# Altium project EEG Measurement B'd.PrjPcb
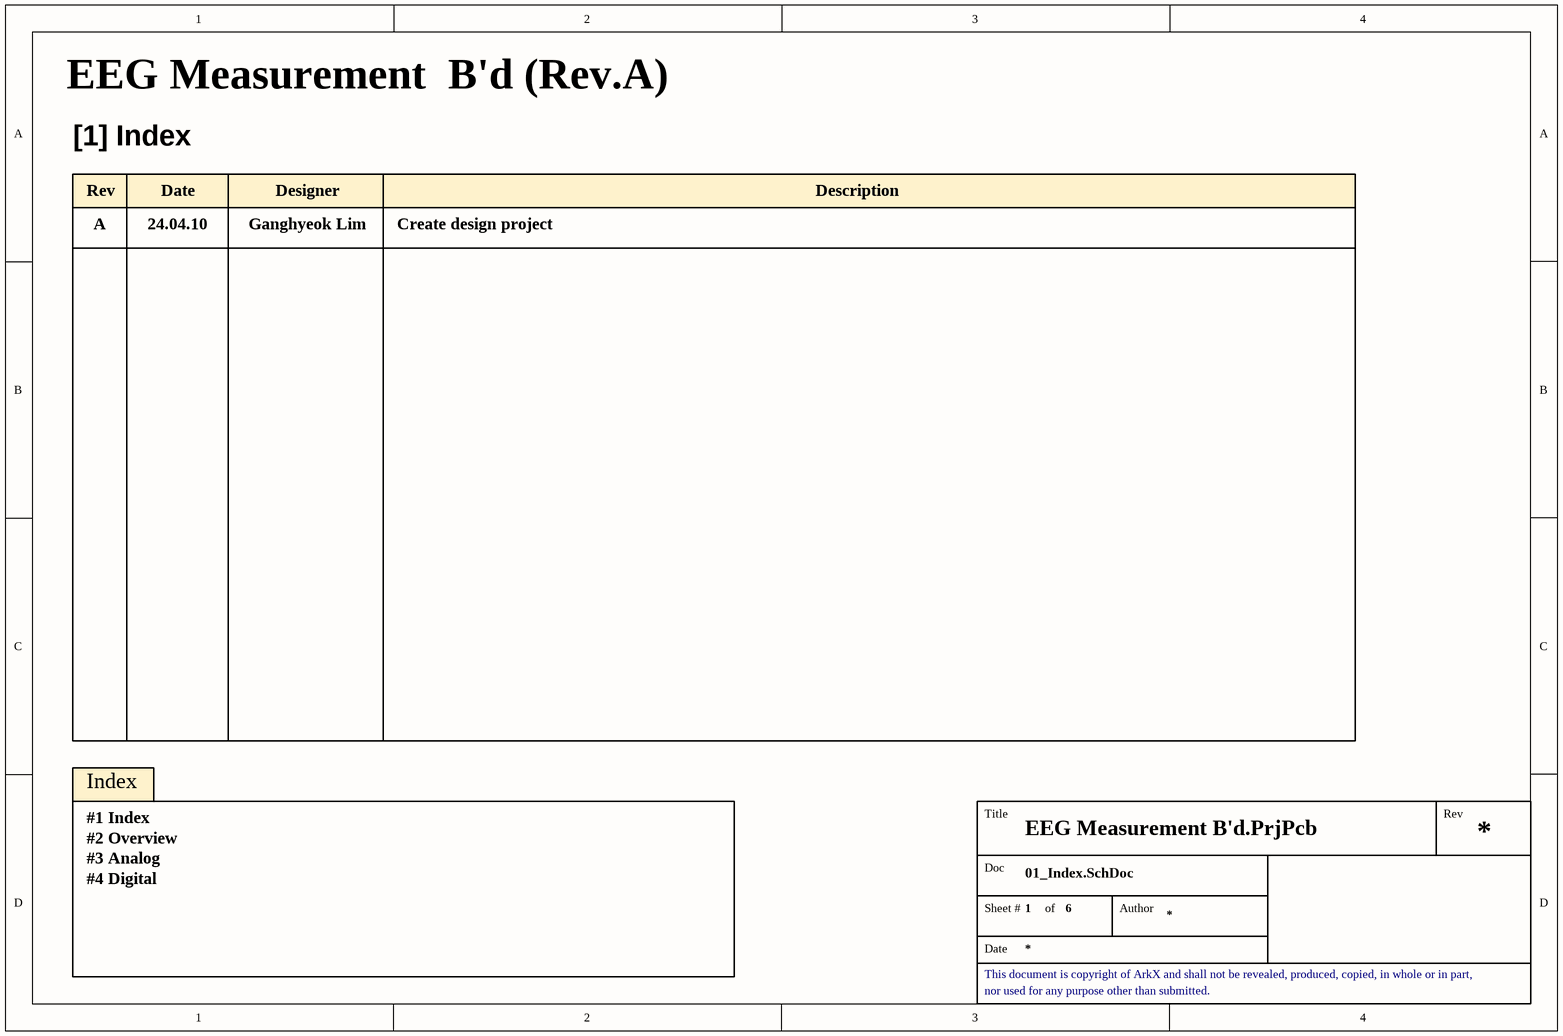
[diagram p0: 01_Index.SchDoc]
5 sheets, 171 parts. Net scope: flat (ports and power ports of the same name join across sheets).
Board file: EEG_Measurement_Bd.PcbDoc
Sheets:
  01_Index.SchDoc
  02_Overview.SchDoc
  03_Power.SchDoc
  04_Analog_Part.SchDoc
  05_Connector.SchDoc

## Sheet 01_Index.SchDoc
size A4; SheetNumber: 1; SheetTotal: 6

### Notes on the sheet
- EEG Measurement  B'd (Rev.A)
- [1] Index
- Rev
- A
- 24.04.10
- Date
- Ganghyeok Lim
- Designer
- Create design project
- Description
- Index
- #1 Index
- #2 Overview
- #3 Analog
- #4 Digital
- Title
- Doc
- Sheet #
- of
- Author
- This document is copyright of ArkX and shall not be revealed, produced, copied, in whole or in part,
- nor used for any purpose other than submitted.

## Sheet 02_Overview.SchDoc
size A4; SheetNumber: 2; SheetTotal: 5
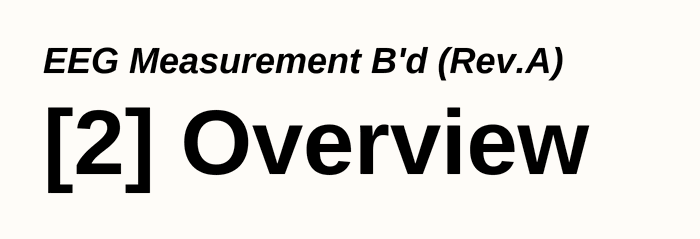
[diagram p1: 02_Overview.SchDoc]

### Notes on the sheet
- EEG Measurement B'd (Rev.A)
- [2] Overview

## Sheet 03_Power.SchDoc
size A3; SheetNumber: 3; SheetTotal: 5
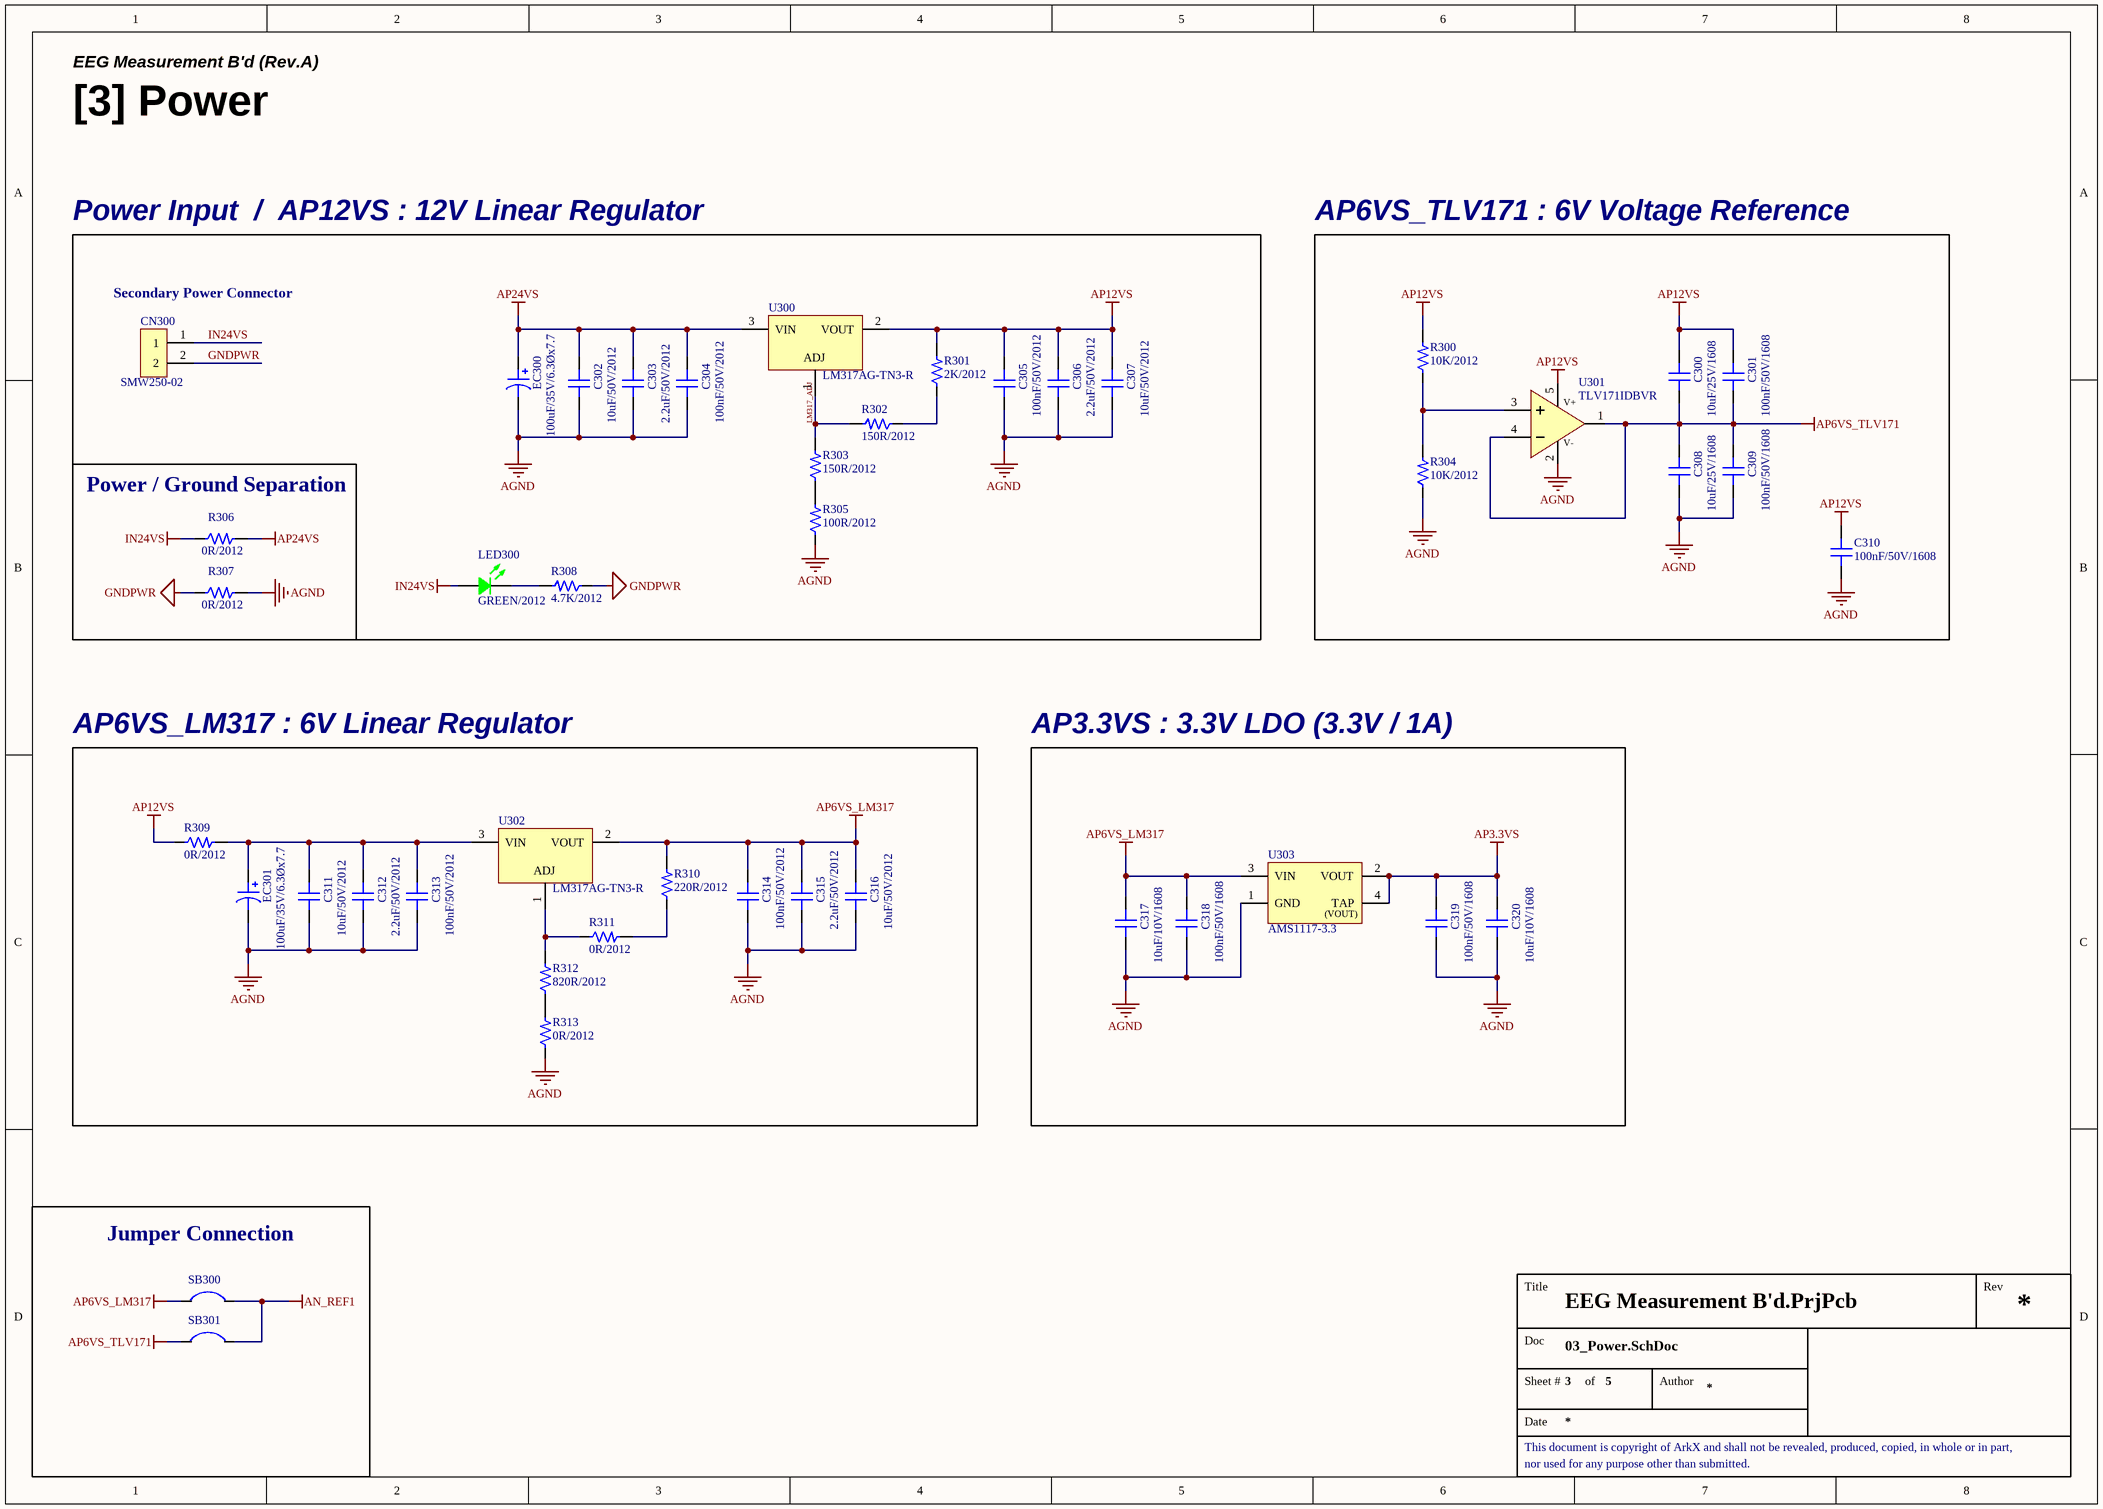
[diagram p2: 03_Power.SchDoc]

### Parts
C300  10uF/25V/1608  [CAP 1608 (0603_INCH)]
C301  100nF/50V/1608  [CAP 1608 (0603_INCH)]
C302  10uF/50V/2012  [CAP 2012 (0805_INCH)]
C303  2.2uF/50V/2012  [CAP 2012 (0805_INCH)]
C304  100nF/50V/2012  [CAP 2012 (0805_INCH)]
C305  100nF/50V/2012  [CAP 2012 (0805_INCH)]
C306  2.2uF/50V/2012  [CAP 2012 (0805_INCH)]
C307  10uF/50V/2012  [CAP 2012 (0805_INCH)]
C308  10uF/25V/1608  [CAP 1608 (0603_INCH)]
C309  100nF/50V/1608  [CAP 1608 (0603_INCH)]
C310  100nF/50V/1608  [CAP 1608 (0603_INCH)]
C311  10uF/50V/2012  [CAP 2012 (0805_INCH)]
C312  2.2uF/50V/2012  [CAP 2012 (0805_INCH)]
C313  100nF/50V/2012  [CAP 2012 (0805_INCH)]
C314  100nF/50V/2012  [CAP 2012 (0805_INCH)]
C315  2.2uF/50V/2012  [CAP 2012 (0805_INCH)]
C316  10uF/50V/2012  [CAP 2012 (0805_INCH)]
C317  10uF/10V/1608  [CAP 1608 (0603_INCH)]
C318  100nF/50V/1608  [CAP 1608 (0603_INCH)]
C319  100nF/50V/1608  [CAP 1608 (0603_INCH)]
C320  10uF/10V/1608  [CAP 1608 (0603_INCH)]
CN300  SMW250-02  [CON_SMW250-02]
EC300  100uF/35V/6.3Øx7.7  [CAP ALSMD 6.6MM H7.7MM]
EC301  100uF/35V/6.3Øx7.7  [CAP ALSMD 6.6MM H7.7MM]
LED300  GREEN/2012  [LED MHT170RGBCT (GREEN)]
R300  10K/2012  [RES 2012 (0805_inch)]
R301  2K/2012  [RES 2012 (0805_inch)]
R302  150R/2012  [RES 2012 (0805_inch)]
R303  150R/2012  [RES 2012 (0805_inch)]
R304  10K/2012  [RES 2012 (0805_inch)]
R305  100R/2012  [RES 2012 (0805_inch)]
R306  0R/2012  [RES 2012 (0805_inch)]
R307  0R/2012  [RES 2012 (0805_inch)]
R308  4.7K/2012  [RES 2012 (0805_inch)]
R309  0R/2012  [RES 2012 (0805_inch)]
R310  220R/2012  [RES 2012 (0805_inch)]
R311  0R/2012  [RES 2012 (0805_inch)]
R312  820R/2012  [RES 2012 (0805_inch)]
R313  0R/2012  [RES 2012 (0805_inch)]
SB300  SB  [SB (Solder-Bridge)]  (value not drawn)
SB301  SB  [SB (Solder-Bridge)]  (value not drawn)
U300  LM317AG-TN3-R  [IC_TO-252-2(DPAK)]
U301  TLV171IDBVR  [SOT-23-5 (TI DBV PACKAGE)]
U302  LM317AG-TN3-R  [IC_TO-252-2(DPAK)]
U303  AMS1117-3.3  [SOT 223-3 (DIODES INCORPORATED)]

### Blocks framed on the sheet
Power Input  /  AP12VS : 12V Linear Regulator: C302-C307 CN300 EC300 LED300 R301-R303 R305 R308 U300
AP6VS_TLV171 : 6V Voltage Reference: C300 C301 C308-C310 R300 R304 U301
Power / Ground Separation: R306 R307
AP6VS_LM317 : 6V Linear Regulator: C311-C316 EC301 R309-R313 U302
AP3.3VS : 3.3V LDO (3.3V / 1A): C317-C320 U303
Jumper Connection: SB300 SB301

### Nets
AGND: C302.1 C303.1 C304.1 C305.1 C306.1 C307.1 C308.1 C309.1 C310.1 C311.1 C312.1 C313.1 C314.1 C315.1 C316.1 C317.1 C318.1 C319.1 C320.1 EC300.2 EC301.2 R304.1 R305.1 R307.2 R313.1 U301.2(V-) U303.1(GND)
AN_REF1: SB300.1 SB301.1
AP3.3VS: C319.2 C320.2 U303.2(VOUT) U303.4(TAP)
AP6VS_LM317: C314.2 C315.2 C316.2 C317.2 C318.2 R310.2 SB300.2 U302.2(VOUT) U303.3(VIN)
AP6VS_TLV171: C300.1 C301.1 C308.2 C309.2 SB301.2 U301.1(OUT) U301.4(IN-)
AP12VS: C300.2 C301.2 C305.2 C306.2 C307.2 C310.2 R300.2 R301.2 R309.1 U300.2(VOUT) U301.5(V+)
AP24VS: C302.2 C303.2 C304.2 EC300.1 R306.2 U300.3(VIN)
GNDPWR: CN300.2 R307.1 R308.1
IN24VS: CN300.1 LED300.4(Common_Anode) R306.1
LM317_ADJ: R302.2 R303.2 U300.1(ADJ)
NetC311_2: C311.2 C312.2 C313.2 EC301.1 R309.2 U302.3(VIN)
NetLED300_2: LED300.2(GREEN) R308.2
NetR300_1: R300.1 R304.2 U301.3(IN+)
NetR301_1: R301.1 R302.1
NetR303_1: R303.1 R305.2
NetR310_1: R310.1 R311.2
NetR311_1: R311.1 R312.2 U302.1(ADJ)
NetR312_1: R312.1 R313.2

### Notes on the sheet
- EEG Measurement B'd (Rev.A)
- [3] Power
- (near CN300) Secondary Power Connector
- Title
- Rev
- Doc
- Sheet #
- of
- Author
- This document is copyright of ArkX and shall not be revealed, produced, copied, in whole or in part,
- Date
- nor used for any purpose other than submitted.
- (in symbol IC_REG_AMS1117-3.3) (VOUT)

### Library data of the parts
C300 C308 = CAP_10uF/25V/1608: Ceramic CAP_10uF/25V/1608; LCSC Part #: C96446; JLCPCB Part Type: Basic Part
C301 C309 C310 C318 C319 = CAP_100nF/50V/1608: Ceramic CAP_100nF/50V/1608; LCSC Part #: C14663; JLCPCB Part Type: Basic Part
C302 C307 C311 C316 = CAP_10uF/50V/2012: Ceramic CAP_10uF/50V/2012; LCSC Part #: C440198; JLCPCB Part Type: Basic Part
C303 C306 C312 C315 = CAP_2.2uF/50V/2012: Ceramic CAP_2.2uF/50V/2012; LCSC Part #: C377773; JLCPCB Part Type: Basic Part
C304 C305 C313 C314 = CAP_100nF/50V/2012: Ceramic CAP_100nF/50V/2012; LCSC Part #: C49678; JLCPCB Part Type: Basic Part
C317 C320 = CAP_10uF/10V/1608: Ceramic CAP_10uF/10V/1608; LCSC Part #: C19702; JLCPCB Part Type: Basic Part
CN300 = CON_SMW250-02: YEONHO 2.5mm Pitch Vertical Connector 2Pin
EC300 EC301 = CAP_EC 100uF/35V/6.3Øx7.7: Eletrolytic CAP_100uF/35V/6.3Øx7.7; LCSC Part #: C176666; JLCPCB Part Type: Extended Part
LED300 = LED_MHT170RGBCT(GREEN): Colorless transparence -30℃~+85℃ Positive post Common anode RGB 120° 0805  Light Emitting Diodes (LED) ROHS; LCSC Part #: C2962094; JLCPCB Part Type: Extended Part
R300 R304 = RES_10K/2012/0.125W: Value: 10K; Power Rating: 0.125W; Precision: 1%; Size: 2012; LCSC Part #: C17414; JLCPCB Part Type: Basic Part
R301 = RES_2K/2012/0.125W: Value: 2K; Power Rating: 0.125W; Precision: 1%; Size: 2012; LCSC Part #: C17604; JLCPCB Part Type: Basic Part
R302 R303 = RES_150R/2012/0.125W: Value: 150R; Power Rating: 0.1W; Precision: 1%; Size: 1608; LCSC Part #: C17471; JLCPCB Part Type: Basic Part
R305 = RES_100R/2012/0.125W: Value: 100R; Power Rating: 0.125W; Precision: 1%; Size: 2012; LCSC Part #: C17408; JLCPCB Part Type: Basic Part
R306 R307 R309 R311 R313 = RES_0R/2012/0.125W: Value: 0R; Power Rating: 0.125W; Precision: 1%; Size: 2012; LCSC Part #: C17477; JLCPCB Part Type: Basic Part
R308 = RES_4.7K/2012/0.125W: Value: 4.7K; Power Rating: 0.125W; Precision: 1%; Size: 2012; LCSC Part #: C17673; JLCPCB Part Type: Basic Part
R310 = RES_220R/2012/0.125W: Value: 220R; Power Rating: 0.125W; Precision: 1%; Size: 2012; LCSC Part #: C17557; JLCPCB Part Type: Basic Part
R312 = RES_820R/2012/0.125W: Value: 820R; Power Rating: 0.125W; Precision: 1%; Size: 2012; LCSC Part #: C17837; JLCPCB Part Type: Basic Part
SB300 SB301 = SB_Solder-Bridge
U300 U302 = IC_REG_LM317AG-TN3-R: 1.5A 5V@(500mA) Adjustable 1.2V~37V Positive 1 40V TO-252-2(DPAK)  Linear Voltage Regulators (LDO) ROHS; LCSC Part #: C75510; JLCPCB Part Type: Basic Part
U301 = IC_OPAMP_TLV171IDBVR: Single, 36-V, 3-MHz, low-power operational amplifier for cost-sensitive applications; LCSC Part #: C2864299; JLCPCB Part Type: Extended Part
U303 = IC_REG_AMS1117-3.3: 72dB@(120Hz) 1A 1.3V@(800mA) Fixed 3.3V~3.3V Positive 1 SOT-223  Linear Voltage Regulators (LDO) ROHS; LCSC Part #: C6186; JLCPCB Part Type: Basic Part

## Sheet 04_Analog_Part.SchDoc
size A2; SheetNumber: 4; SheetTotal: 5
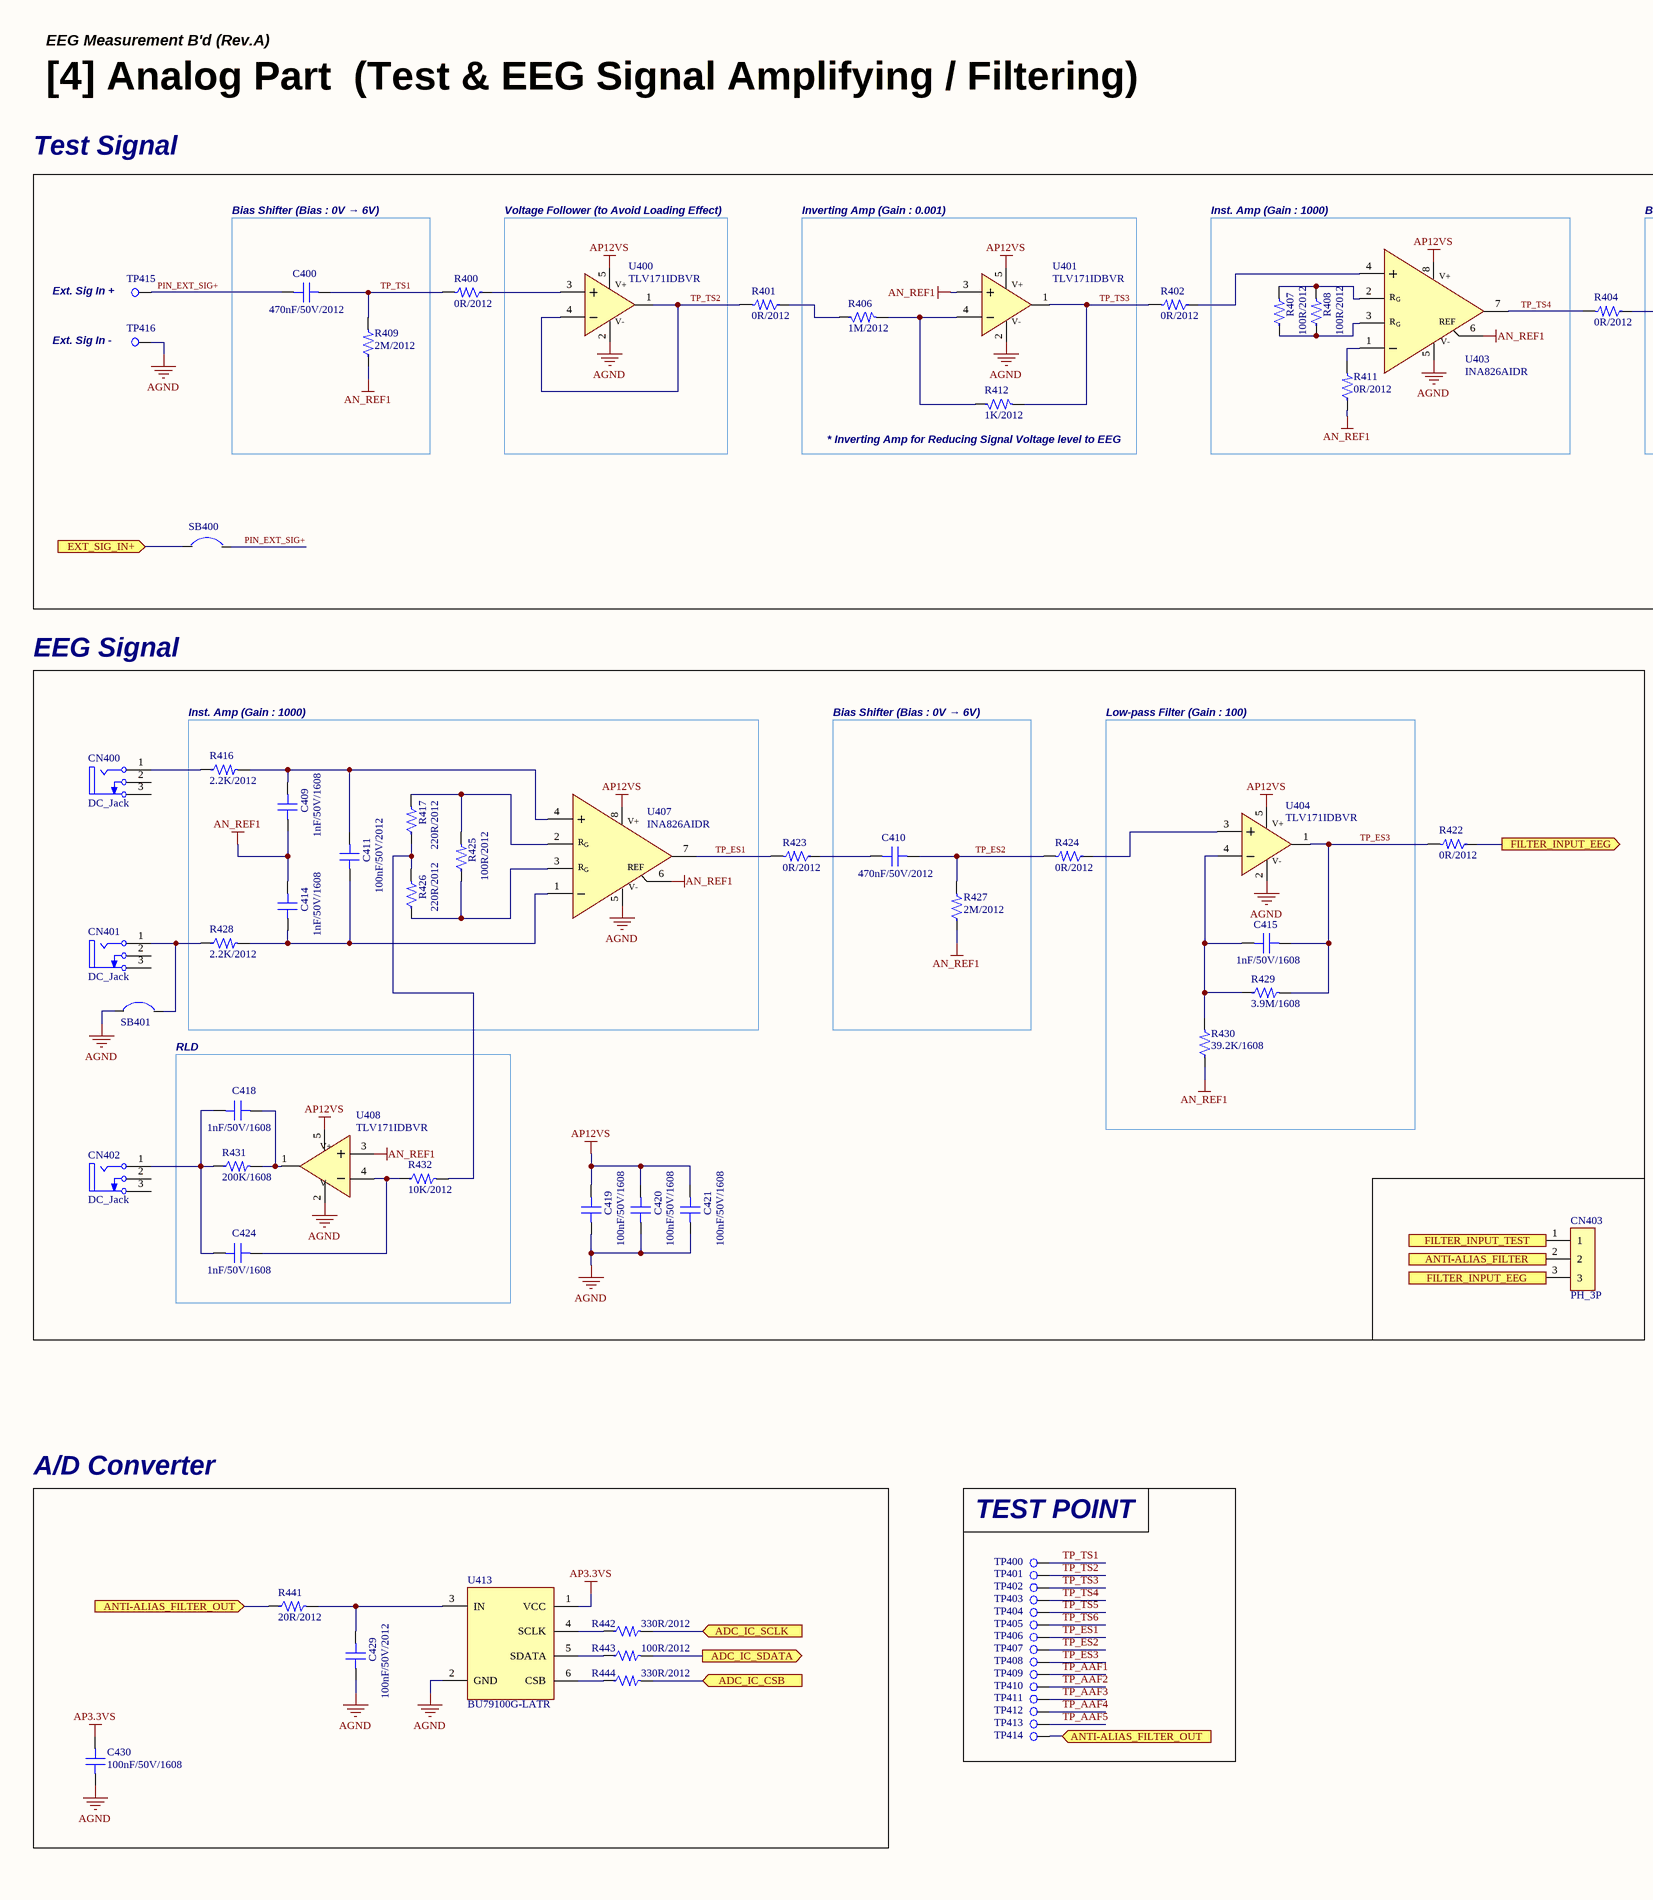
[diagram p3: 04_Analog_Part.SchDoc, left]
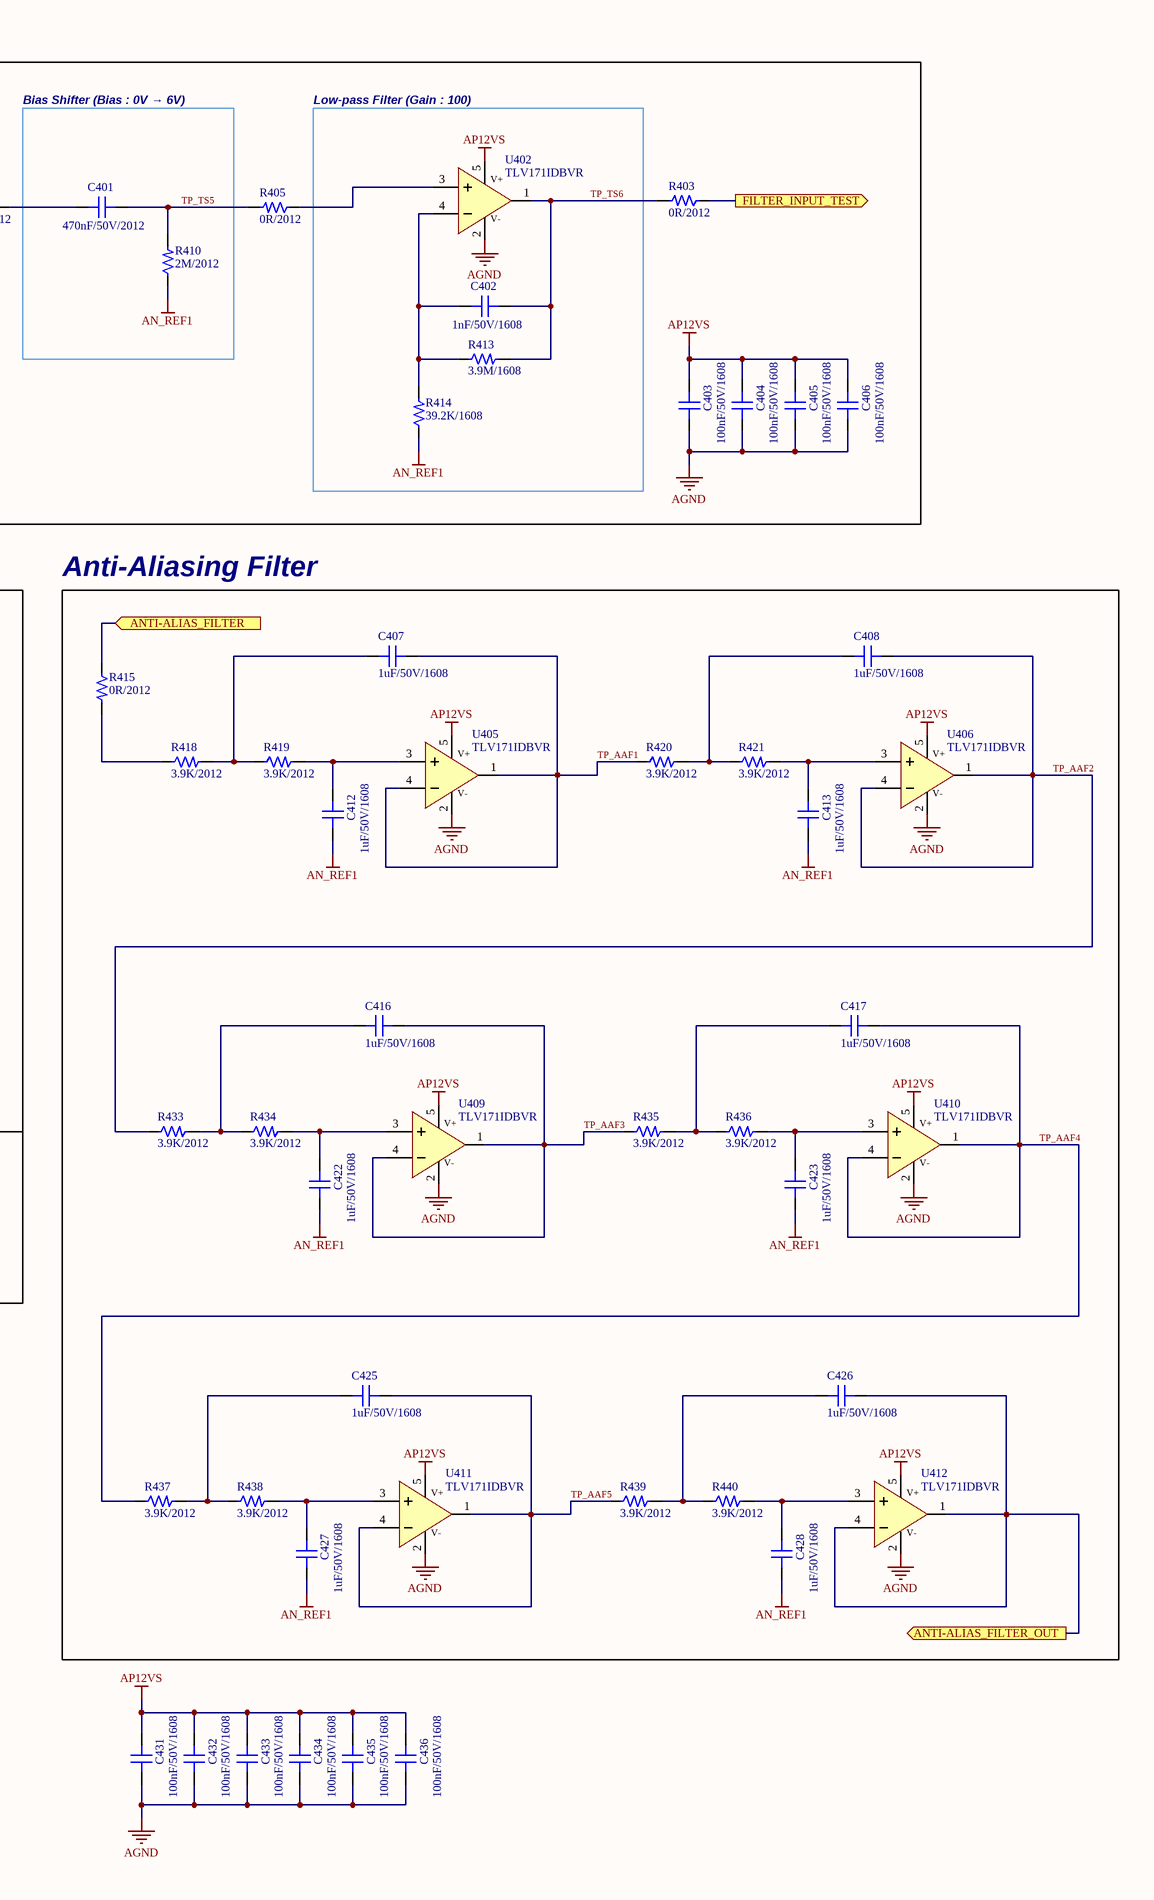
[diagram p4: 04_Analog_Part.SchDoc, right]

### Parts
C400  470nF/50V/2012  [CAP 2012 (0805_INCH)]
C401  470nF/50V/2012  [CAP 2012 (0805_INCH)]
C402  1nF/50V/1608  [CAP 1608 (0603_INCH)]
C403  100nF/50V/1608  [CAP 1608 (0603_INCH)]
C404  100nF/50V/1608  [CAP 1608 (0603_INCH)]
C405  100nF/50V/1608  [CAP 1608 (0603_INCH)]
C406  100nF/50V/1608  [CAP 1608 (0603_INCH)]
C407  1uF/50V/1608  [CAP 1608 (0603_INCH)]
C408  1uF/50V/1608  [CAP 1608 (0603_INCH)]
C409  1nF/50V/1608  [CAP 1608 (0603_INCH)]
C410  470nF/50V/2012  [CAP 2012 (0805_INCH)]
C411  100nF/50V/2012  [CAP 2012 (0805_INCH)]
C412  1uF/50V/1608  [CAP 1608 (0603_INCH)]
C413  1uF/50V/1608  [CAP 1608 (0603_INCH)]
C414  1nF/50V/1608  [CAP 1608 (0603_INCH)]
C415  1nF/50V/1608  [CAP 1608 (0603_INCH)]
C416  1uF/50V/1608  [CAP 1608 (0603_INCH)]
C417  1uF/50V/1608  [CAP 1608 (0603_INCH)]
C418  1nF/50V/1608  [CAP 1608 (0603_INCH)]
C419  100nF/50V/1608  [CAP 1608 (0603_INCH)]
C420  100nF/50V/1608  [CAP 1608 (0603_INCH)]
C421  100nF/50V/1608  [CAP 1608 (0603_INCH)]
C422  1uF/50V/1608  [CAP 1608 (0603_INCH)]
C423  1uF/50V/1608  [CAP 1608 (0603_INCH)]
C424  1nF/50V/1608  [CAP 1608 (0603_INCH)]
C425  1uF/50V/1608  [CAP 1608 (0603_INCH)]
C426  1uF/50V/1608  [CAP 1608 (0603_INCH)]
C427  1uF/50V/1608  [CAP 1608 (0603_INCH)]
C428  1uF/50V/1608  [CAP 1608 (0603_INCH)]
C429  100nF/50V/2012  [CAP 2012 (0805_INCH)]
C430  100nF/50V/1608  [CAP 1608 (0603_INCH)]
C431  100nF/50V/1608  [CAP 1608 (0603_INCH)]
C432  100nF/50V/1608  [CAP 1608 (0603_INCH)]
C433  100nF/50V/1608  [CAP 1608 (0603_INCH)]
C434  100nF/50V/1608  [CAP 1608 (0603_INCH)]
C435  100nF/50V/1608  [CAP 1608 (0603_INCH)]
C436  100nF/50V/1608  [CAP 1608 (0603_INCH)]
CN400  DC_Jack  [CON DC-Jack]
CN401  DC_Jack  [CON DC-Jack]
CN402  DC_Jack  [CON DC-Jack]
CN403  PH_3P  [CON PIN_HEADER-3PIN(2.54MM)]
R400  0R/2012  [RES 2012 (0805_inch)]
R401  0R/2012  [RES 2012 (0805_inch)]
R402  0R/2012  [RES 2012 (0805_inch)]
R403  0R/2012  [RES 2012 (0805_inch)]
R404  0R/2012  [RES 2012 (0805_inch)]
R405  0R/2012  [RES 2012 (0805_inch)]
R406  1M/2012  [RES 2012 (0805_inch)]
R407  100R/2012  [RES 2012 (0805_inch)]
R408  100R/2012  [RES 2012 (0805_inch)]
R409  2M/2012  [RES 2012 (0805_inch)]
R410  2M/2012  [RES 2012 (0805_inch)]
R411  0R/2012  [RES 2012 (0805_inch)]
R412  1K/2012  [RES 2012 (0805_inch)]
R413  3.9M/1608  [RES 1608 (0603_inch)]
R414  39.2K/1608  [RES 1608 (0603_inch)]
R415  0R/2012  [RES 2012 (0805_inch)]
R416  2.2K/2012  [RES 2012 (0805_inch)]
R417  220R/2012  [RES 2012 (0805_inch)]
R418  3.9K/2012  [RES 2012 (0805_inch)]
R419  3.9K/2012  [RES 2012 (0805_inch)]
R420  3.9K/2012  [RES 2012 (0805_inch)]
R421  3.9K/2012  [RES 2012 (0805_inch)]
R422  0R/2012  [RES 2012 (0805_inch)]
R423  0R/2012  [RES 2012 (0805_inch)]
R424  0R/2012  [RES 2012 (0805_inch)]
R425  100R/2012  [RES 2012 (0805_inch)]
R426  220R/2012  [RES 2012 (0805_inch)]
R427  2M/2012  [RES 2012 (0805_inch)]
R428  2.2K/2012  [RES 2012 (0805_inch)]
R429  3.9M/1608  [RES 1608 (0603_inch)]
R430  39.2K/1608  [RES 1608 (0603_inch)]
R431  200K/1608  [RES 1608 (0603_inch)]
R432  10K/2012  [RES 2012 (0805_inch)]
R433  3.9K/2012  [RES 2012 (0805_inch)]
R434  3.9K/2012  [RES 2012 (0805_inch)]
R435  3.9K/2012  [RES 2012 (0805_inch)]
R436  3.9K/2012  [RES 2012 (0805_inch)]
R437  3.9K/2012  [RES 2012 (0805_inch)]
R438  3.9K/2012  [RES 2012 (0805_inch)]
R439  3.9K/2012  [RES 2012 (0805_inch)]
R440  3.9K/2012  [RES 2012 (0805_inch)]
R441  20R/2012  [RES 2012 (0805_inch)]
R442  330R/2012  [RES 2012 (0805_inch)]
R443  100R/2012  [RES 2012 (0805_inch)]
R444  330R/2012  [RES 2012 (0805_inch)]
SB400  SB  [SB (Solder-Bridge)]  (value not drawn)
SB401  SB  [SB (Solder-Bridge)]  (value not drawn)
TP400  TP_HOLE(1MM)  [TP_HOLE(1MM)]  (value not drawn)
TP401  TP_HOLE(1MM)  [TP_HOLE(1MM)]  (value not drawn)
TP402  TP_HOLE(1MM)  [TP_HOLE(1MM)]  (value not drawn)
TP403  TP_HOLE(1MM)  [TP_HOLE(1MM)]  (value not drawn)
TP404  TP_HOLE(1MM)  [TP_HOLE(1MM)]  (value not drawn)
TP405  TP_HOLE(1MM)  [TP_HOLE(1MM)]  (value not drawn)
TP406  TP_HOLE(1MM)  [TP_HOLE(1MM)]  (value not drawn)
TP407  TP_HOLE(1MM)  [TP_HOLE(1MM)]  (value not drawn)
TP408  TP_HOLE(1MM)  [TP_HOLE(1MM)]  (value not drawn)
TP409  TP_HOLE(1MM)  [TP_HOLE(1MM)]  (value not drawn)
TP410  TP_HOLE(1MM)  [TP_HOLE(1MM)]  (value not drawn)
TP411  TP_HOLE(1MM)  [TP_HOLE(1MM)]  (value not drawn)
TP412  TP_HOLE(1MM)  [TP_HOLE(1MM)]  (value not drawn)
TP413  TP_HOLE(1MM)  [TP_HOLE(1MM)]  (value not drawn)
TP414  TP_HOLE(1MM)  [TP_HOLE(1MM)]  (value not drawn)
TP415  TP_HOLE(1MM)  [TP_HOLE(1MM)]  (value not drawn)
TP416  TP_HOLE(1MM)  [TP_HOLE(1MM)]  (value not drawn)
U400  TLV171IDBVR  [SOT-23-5 (TI DBV PACKAGE)]
U401  TLV171IDBVR  [SOT-23-5 (TI DBV PACKAGE)]
U402  TLV171IDBVR  [SOT-23-5 (TI DBV PACKAGE)]
U403  INA826AIDR  [IC_SOIC-8 (4.90x3.90mm)]
U404  TLV171IDBVR  [SOT-23-5 (TI DBV PACKAGE)]
U405  TLV171IDBVR  [SOT-23-5 (TI DBV PACKAGE)]
U406  TLV171IDBVR  [SOT-23-5 (TI DBV PACKAGE)]
U407  INA826AIDR  [IC_SOIC-8 (4.90x3.90mm)]
U408  TLV171IDBVR  [SOT-23-5 (TI DBV PACKAGE)]
U409  TLV171IDBVR  [SOT-23-5 (TI DBV PACKAGE)]
U410  TLV171IDBVR  [SOT-23-5 (TI DBV PACKAGE)]
U411  TLV171IDBVR  [SOT-23-5 (TI DBV PACKAGE)]
U412  TLV171IDBVR  [SOT-23-5 (TI DBV PACKAGE)]
U413  BU79100G-LATR  [IC_SOT-23-6]

### Blocks framed on the sheet
Test Signal: C403-C406 R400-R406 R412 SB400 TP415 TP416 U401
Bias Shifter (Bias : 0V → 6V): C400 R409
Voltage Follower (to Avoid Loading Effect): U400
Inst. Amp (Gain : 1000): R407 R408 R411 U403
Bias Shifter (Bias : 0V → 6V): C401 R410
Low-pass Filter (Gain : 100): C402 R413 R414 U402
EEG Signal: C419-C421 CN400-CN403 R422-R424 SB401
Anti-Aliasing Filter: C407 C408 C412 C413 C416 C417 C422 C423 C425-C428 R415 R418-R421 R433-R440 U405 U406 U409-U412
Inst. Amp (Gain : 1000): C409 C411 C414 R416 R417 R425 R426 R428 U407
Bias Shifter (Bias : 0V → 6V): C410 R427
Low-pass Filter (Gain : 100): C415 R429 R430 U404
RLD: C418 C424 R431 R432 U408
A/D Converter: C429 C430 R441-R444 U413
TEST POINT: TP400-TP414

### Ports
ADC_IC_CSB (in), ADC_IC_SCLK (in), ADC_IC_SDATA (out), ANTI-ALIAS_FILTER (in), ANTI-ALIAS_FILTER (out), ANTI-ALIAS_FILTER_OUT (in), ANTI-ALIAS_FILTER_OUT (out), EXT_SIG_IN+ (in), FILTER_INPUT_EEG (in), FILTER_INPUT_EEG (out), FILTER_INPUT_TEST (in), FILTER_INPUT_TEST (out)

### Nets
AGND: C403.1 C404.1 C405.1 C406.1 C419.1 C420.1 C421.1 C429.1 C430.1 C431.1 C432.1 C433.1 C434.1 C435.1 C436.1 SB401.1 TP416.1(TP) U400.2(V-) U401.2(V-) U402.2(V-) U403.5(V-) U404.2(V-) U405.2(V-) U406.2(V-) U407.5(V-) U408.2(V-) U409.2(V-) U410.2(V-) U411.2(V-) U412.2(V-) U413.2(GND)
AN_REF1: C409.1 C412.1 C413.1 C414.2 C422.1 C423.1 C427.1 C428.1 R409.1 R410.1 R411.1 R414.1 R427.1 R430.1 U401.3(IN+) U403.6(REF) U407.6(REF) U408.3(IN+)
AP3.3VS: C430.2 U413.1(VCC)
AP12VS: C403.2 C404.2 C405.2 C406.2 C419.2 C420.2 C421.2 C431.2 C432.2 C433.2 C434.2 C435.2 C436.2 U400.5(V+) U401.5(V+) U402.5(V+) U403.8(V+) U404.5(V+) U405.5(V+) U406.5(V+) U407.8(V+) U408.5(V+) U409.5(V+) U410.5(V+) U411.5(V+) U412.5(V+)
ADC_IC_CSB: R444.2 ; port ADC_IC_CSB
ADC_IC_SCLK: R442.2 ; port ADC_IC_SCLK
ADC_IC_SDATA: R443.2 ; port ADC_IC_SDATA
ANTI-ALIAS_FILTER: CN403.2 R415.1 ; port ANTI-ALIAS_FILTER
ANTI-ALIAS_FILTER_OUT: C426.2 R441.1 TP414.1(TP) U412.1(OUT) U412.4(IN-) ; port ANTI-ALIAS_FILTER_OUT
EXT_SIG_IN+: SB400.1 ; port EXT_SIG_IN+
FILTER_INPUT_EEG: CN403.3 R422.1 ; port FILTER_INPUT_EEG
FILTER_INPUT_TEST: CN403.1 R403.1 ; port FILTER_INPUT_TEST
PIN_EXT_SIG+: C400.1 SB400.2 TP415.1(TP)
TP_AAF1: C407.2 R420.1 TP409.1(TP) U405.1(OUT) U405.4(IN-)
TP_AAF2: C408.2 R433.1 TP410.1(TP) U406.1(OUT) U406.4(IN-)
TP_AAF3: C416.2 R435.1 TP411.1(TP) U409.1(OUT) U409.4(IN-)
TP_AAF4: C417.2 R437.1 TP412.1(TP) U410.1(OUT) U410.4(IN-)
TP_AAF5: C425.2 R439.1 TP413.1(TP) U411.1(OUT) U411.4(IN-)
TP_ES1: R423.2 TP406.1(TP) U407.7(VOUT)
TP_ES2: C410.2 R424.2 R427.2 TP407.1(TP)
TP_ES3: C415.1 R422.2 R429.2 TP408.1(TP) U404.1(OUT)
TP_TS1: C400.2 R400.2 R409.2 TP400.1(TP)
TP_TS2: R401.2 TP401.1(TP) U400.1(OUT) U400.4(IN-)
TP_TS3: R402.2 R412.2 TP402.1(TP) U401.1(OUT)
TP_TS4: R404.2 TP403.1(TP) U403.7(VOUT)
TP_TS5: C401.2 R405.2 R410.2 TP404.1(TP)
TP_TS6: C402.1 R403.2 R413.2 TP405.1(TP) U402.1(OUT)
NetC401_1: C401.1 R404.1
NetC402_2: C402.2 R413.1 R414.2 U402.4(IN-)
NetC407_1: C407.1 R418.2 R419.1
NetC408_1: C408.1 R420.2 R421.1
NetC409_2: C409.2 C411.2 R416.2 U407.4(IN+)
NetC410_1: C410.1 R423.1
NetC411_1: C411.1 C414.1 R428.2 U407.1(IN-)
NetC412_2: C412.2 R419.2 U405.3(IN+)
NetC413_2: C413.2 R421.2 U406.3(IN+)
NetC415_2: C415.2 R429.1 R430.2 U404.4(IN-)
NetC416_1: C416.1 R433.2 R434.1
NetC417_1: C417.1 R435.2 R436.1
NetC418_1: C418.1 R431.2 U408.1(OUT)
NetC418_2: C418.2 C424.2 CN402.1(VCC) R431.1
NetC422_2: C422.2 R434.2 U409.3(IN+)
NetC423_2: C423.2 R436.2 U410.3(IN+)
NetC424_1: C424.1 R432.1 U408.4(IN-)
NetC425_1: C425.1 R437.2 R438.1
NetC426_1: C426.1 R439.2 R440.1
NetC427_2: C427.2 R438.2 U411.3(IN+)
NetC428_2: C428.2 R440.2 U412.3(IN+)
NetC429_2: C429.2 R441.2 U413.3(IN)
NetCN400_1: CN400.1(VCC) R416.1
NetCN401_1: CN401.1(VCC) R428.1 SB401.2
NetR400_1: R400.1 U400.3(IN+)
NetR401_1: R401.1 R406.1
NetR402_1: R402.1 U403.4(IN+)
NetR405_1: R405.1 U402.3(IN+)
NetR406_2: R406.2 R412.1 U401.4(IN-)
NetR407_1: R407.1 R408.1 U403.3(RG-)
NetR407_2: R407.2 R408.2 U403.2(RG+)
NetR411_2: R411.2 U403.1(IN-)
NetR415_2: R415.2 R418.1
NetR417_1: R417.1 R426.2 R432.2
NetR417_2: R417.2 R425.2 U407.2(RG+)
NetR424_1: R424.1 U404.3(IN+)
NetR425_1: R425.1 R426.1 U407.3(RG-)
NetR442_1: R442.1 U413.4(SCLK)
NetR443_1: R443.1 U413.5(SDATA)
NetR444_1: R444.1 U413.6(CSB)

Not connected (* = marked no-connect by the designer): CN400 2(GND) 3(GND); CN401 2(GND) 3(GND); CN402 2(GND) 3(GND)

### Notes on the sheet
- EEG Measurement B'd (Rev.A)
- [4] Analog Part  (Test & EEG Signal Amplifying / Filtering)
- Inverting Amp (Gain : 0.001)
- (near TP415) Ext. Sig In +
- (near TP416) Ext. Sig In -
- (near R412) * Inverting Amp for Reducing Signal Voltage level to EEG
- Title
- Rev
- Doc
- Sheet #
- of
- Author
- This document is copyright of ArkX and shall not be revealed, produced, copied, in whole or in part,
- Date
- nor used for any purpose other than submitted.
- (in symbol IC_INST-AMP_INA826AIDR) R; G

### Library data of the parts
C400 C401 C410 = CAP_470nF/50V/2012: Ceramic CAP_470nF/50V/2012; LCSC Part #: C13967; JLCPCB Part Type: Basic Part
C402 C409 C414 C415 C418 C424 = CAP_1nF/50V/1608: Ceramic CAP_1nF/50V/1608; LCSC Part #: C1588; JLCPCB Part Type: Basic Part
C403-C406 C419-C421 C430-C436 = CAP_100nF/50V/1608: Ceramic CAP_100nF/50V/1608; LCSC Part #: C14663; JLCPCB Part Type: Basic Part
C407 C408 C412 C413 C416 C417 C422 C423 C425-C428 = CAP_1uF/50V/1608: Ceramic CAP_1uF/50V/1608; LCSC Part #: C15849; JLCPCB Part Type: Basic Part
C411 C429 = CAP_100nF/50V/2012: Ceramic CAP_100nF/50V/2012; LCSC Part #: C49678; JLCPCB Part Type: Basic Part
CN400-CN402 = CON_DC-Jack: ComponentLink1Description: Manufacturer Link; ComponentLink1URL: http://www.cliffuk.co.uk/
CN403 = CON_PIN_HEADER_SINGLE-3PIN(2.54MM)
R400-R405 R411 R415 R422-R424 = RES_0R/2012/0.125W: as R306 on sheet 03_Power; Size: 2012; LCSC Part #: C17477; JLCPCB Part Type: Basic Part
R406 = RES_1M/2012/0.125W: Value: 1M; Power Rating: 0.125W; Precision: 1%; Size: 2012; LCSC Part #: C17514; JLCPCB Part Type: Basic Part
R407 R408 R425 R443 = RES_100R/2012/0.125W: as R305 on sheet 03_Power; Size: 2012; LCSC Part #: C17408; JLCPCB Part Type: Basic Part
R409 R410 R427 = RES_2M/2012/0.125W: Value: 2M; Power Rating: 0.125W; Precision: 1%; Size: 2012; LCSC Part #: C26112; JLCPCB Part Type: Basic Part
R412 = RES_1K/2012/0.125W: Value: 1K; Power Rating: 0.125W; Precision: 1%; Size: 2012; LCSC Part #: C17513; JLCPCB Part Type: Basic Part
R413 R429 = RES_3.9M/1608/0.1W: Value: 3.9M; Power Rating: 0.1W; Precision: 1%; Size: 1608; LCSC Part #: C227875; JLCPCB Part Type: Extended Part
R414 R430 = RES_39.2K/1608/0.1W: Value: 39.2K; Power Rating: 0.1W; Precision: 1%; Size: 1608; LCSC Part #: C137734; JLCPCB Part Type: Extended Part
R416 R428 = RES_2.2K/2012/0.125W: Value: 2.2K; Power Rating: 0.125W; Precision: 1%; Size: 2012; LCSC Part #: C17520; JLCPCB Part Type: Basic Part
R417 R426 = RES_220R/2012/0.125W: as R310 on sheet 03_Power; Size: 2012; LCSC Part #: C17557; JLCPCB Part Type: Basic Part
R418-R421 R433-R440 = RES_3.9K/2012/0.125W: Value: 3.9K; Power Rating: 0.125W; Precision: 1%; Size: 2012; LCSC Part #: C17614; JLCPCB Part Type: Basic Part
R431 = RES_200K/1608/0.1W: Value: 200K; Power Rating: 0.1W; Precision: 1%; Size: 1608; LCSC Part #: C25811; JLCPCB Part Type: Basic Part
R432 = RES_10K/2012/0.125W: as R300 on sheet 03_Power; Size: 2012; LCSC Part #: C17414; JLCPCB Part Type: Basic Part
R441 = RES_20R/2012/0.125W: Value: 20R; Power Rating: 0.125W; Precision: 1%; Size: 2012; LCSC Part #: C17544; JLCPCB Part Type: Basic Part
R442 R444 = RES_330R/2012/0.125W: Value: 330R; Power Rating: 0.125W; Precision: 1%; Size: 2012; LCSC Part #: C17630; JLCPCB Part Type: Basic Part
SB400 SB401 = SB_Solder-Bridge
U400-U402 U404-U406 U408-U412 = IC_OPAMP_TLV171IDBVR: as U301 on sheet 03_Power; LCSC Part #: C2864299; JLCPCB Part Type: Extended Part
U403 U407 = IC_INST-AMP_INA826AIDR: 35nA 40uV 1MHz Single SOIC-8  Instrumentation OpAmps ROHS; LCSC Part #: C38433; JLCPCB Part Type: Extended Part
U413 = IC_ADC_BU79100G-LATR: Successive Approximation A/D Converter / 12 bit, 0.5 MSPS to 1 MSPS, 2.7 V to 5.25 V, / 1-channel, SPI Interface; LCSC Part #: None; JLCPCB Part Type: None

## Sheet 05_Connector.SchDoc
size A4; SheetNumber: 5; SheetTotal: 5
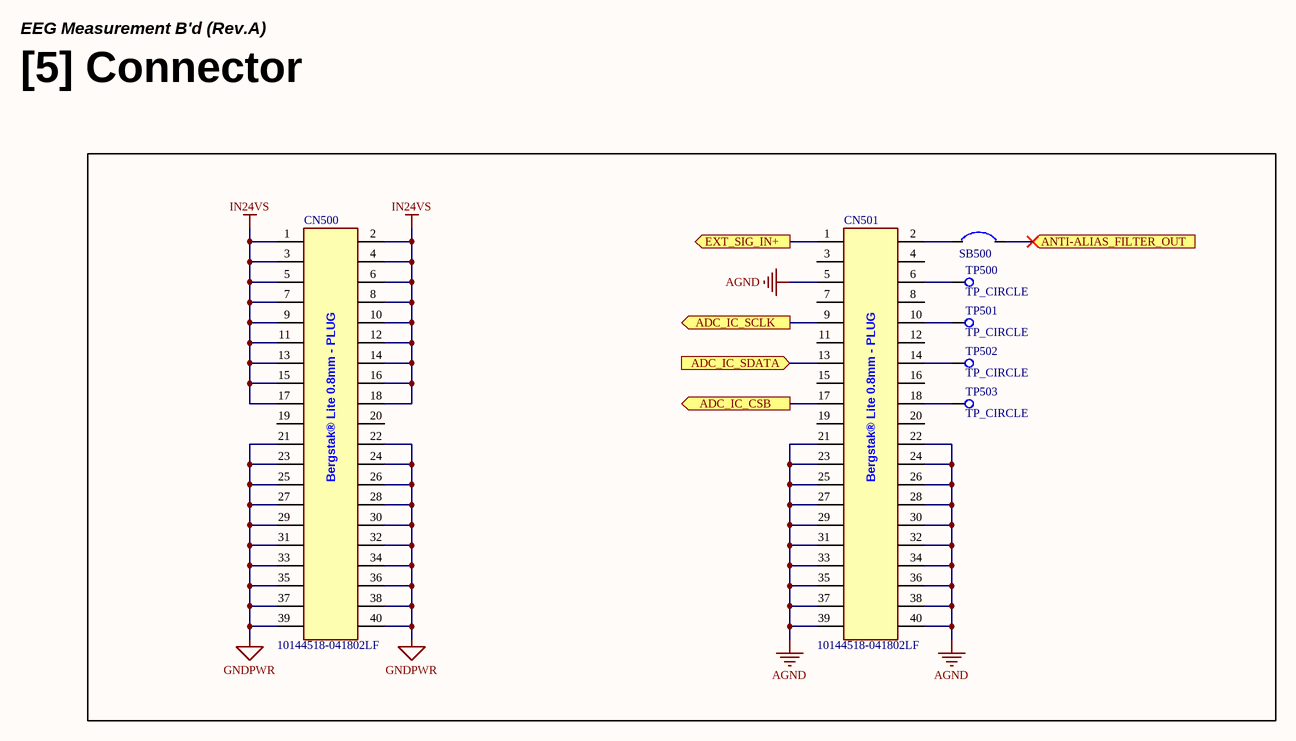
[diagram p5: 05_Connector.SchDoc]

### Parts
CN500  10144518-041802LF  [CON_BergStak-Lite(0.8mm)_PLUG-40P(10144518-041802LF)]
CN501  10144518-041802LF  [CON_BergStak-Lite(0.8mm)_PLUG-40P(10144518-041802LF)]
SB500  SB  [SB (Solder-Bridge)]  (value not drawn)
TP500  TP_CIRCLE  [TP Circle]
TP501  TP_CIRCLE  [TP Circle]
TP502  TP_CIRCLE  [TP Circle]
TP503  TP_CIRCLE  [TP Circle]

### Ports
ADC_IC_CSB (out), ADC_IC_SCLK (out), ADC_IC_SDATA (in), ANTI-ALIAS_FILTER_OUT (in), EXT_SIG_IN+ (out)

### Nets
AGND: CN501.5 CN501.21 CN501.22 CN501.23 CN501.24 CN501.25 CN501.26 CN501.27 CN501.28 CN501.29 CN501.30 CN501.31 CN501.32 CN501.33 CN501.34 CN501.35 CN501.36 CN501.37 CN501.38 CN501.39 CN501.40
GNDPWR: CN500.21 CN500.22 CN500.23 CN500.24 CN500.25 CN500.26 CN500.27 CN500.28 CN500.29 CN500.30 CN500.31 CN500.32 CN500.33 CN500.34 CN500.35 CN500.36 CN500.37 CN500.38 CN500.39 CN500.40
IN24VS: CN500.1 CN500.2 CN500.3 CN500.4 CN500.5 CN500.6 CN500.7 CN500.8 CN500.9 CN500.10 CN500.11 CN500.12 CN500.13 CN500.14 CN500.15 CN500.16 CN500.17 CN500.18
ADC_IC_CSB: CN501.17 ; port ADC_IC_CSB
ADC_IC_SCLK: CN501.9 ; port ADC_IC_SCLK
ADC_IC_SDATA: CN501.13 ; port ADC_IC_SDATA
ANTI-ALIAS_FILTER_OUT: SB500.2 ; port ANTI-ALIAS_FILTER_OUT
EXT_SIG_IN+: CN501.1 ; port EXT_SIG_IN+
NetCN501_2: CN501.2 SB500.1
NetCN501_6: CN501.6 TP500.1(TP)
NetCN501_10: CN501.10 TP501.1(TP)
NetCN501_14: CN501.14 TP502.1(TP)
NetCN501_18: CN501.18 TP503.1(TP)

Not connected (* = marked no-connect by the designer): CN500 19 20; CN501 3 4 7 8 11 12 15 16 19 20

### Notes on the sheet
- EEG Measurement B'd (Rev.A)
- [5] Connector
- Title
- Rev
- Doc
- Sheet #
- of
- Author
- This document is copyright of ArkX and shall not be revealed, produced, copied, in whole or in part,
- Date
- nor used for any purpose other than submitted.
- (in symbol CON_BergStak-Lite(0.8mm)_PLUG-40P(10144518-041802LF)) Bergstak® Lite 0.8mm - PLUG

### Library data of the parts
CN500 CN501 = CON_BergStak-Lite(0.8mm)_PLUG-40P(10144518-041802LF): LCSC Part #: C5410298; JLCPCB Part Type: Extended Part
SB500 = SB_Solder-Bridge

## Nets that join several sheets
AGND: 03_Power (27 pins), 04_Analog_Part (31 pins), 05_Connector (21 pins)
AN_REF1: 03_Power (SB300.1 SB301.1), 04_Analog_Part (18 pins)
AP3.3VS: 03_Power (C319.2 C320.2 U303.2 U303.4), 04_Analog_Part (C430.2 U413.1)
AP12VS: 03_Power (11 pins), 04_Analog_Part (26 pins)
GNDPWR: 03_Power (CN300.2 R307.1 R308.1), 05_Connector (20 pins)
IN24VS: 03_Power (CN300.1 LED300.4 R306.1), 05_Connector (18 pins)
ADC_IC_CSB: 04_Analog_Part (R444.2), 05_Connector (CN501.17)
ADC_IC_SCLK: 04_Analog_Part (R442.2), 05_Connector (CN501.9)
ADC_IC_SDATA: 04_Analog_Part (R443.2), 05_Connector (CN501.13)
ANTI-ALIAS_FILTER_OUT: 04_Analog_Part (5 pins), 05_Connector (SB500.2)
EXT_SIG_IN+: 04_Analog_Part (SB400.1), 05_Connector (CN501.1)